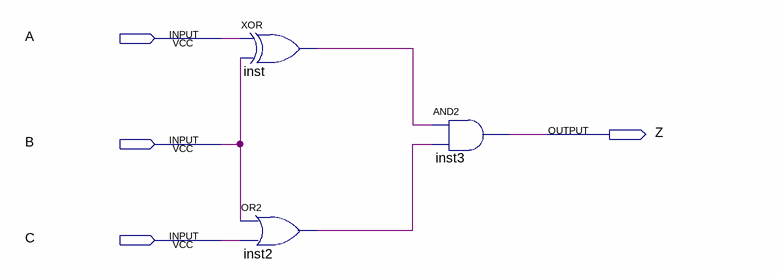
[diagram p0: schematic sheet]
// Quartus schematic lab1.bdf as structural Verilog: 3 symbols, 4 pins
module lab1 (
  input  A,
  input  B,
  input  C,
  output Z
);

  wire inst2_out, inst_out;

  xor inst (inst_out, A, B);
  or inst2 (inst2_out, B, C);
  and inst3 (Z, inst_out, inst2_out);
endmodule
